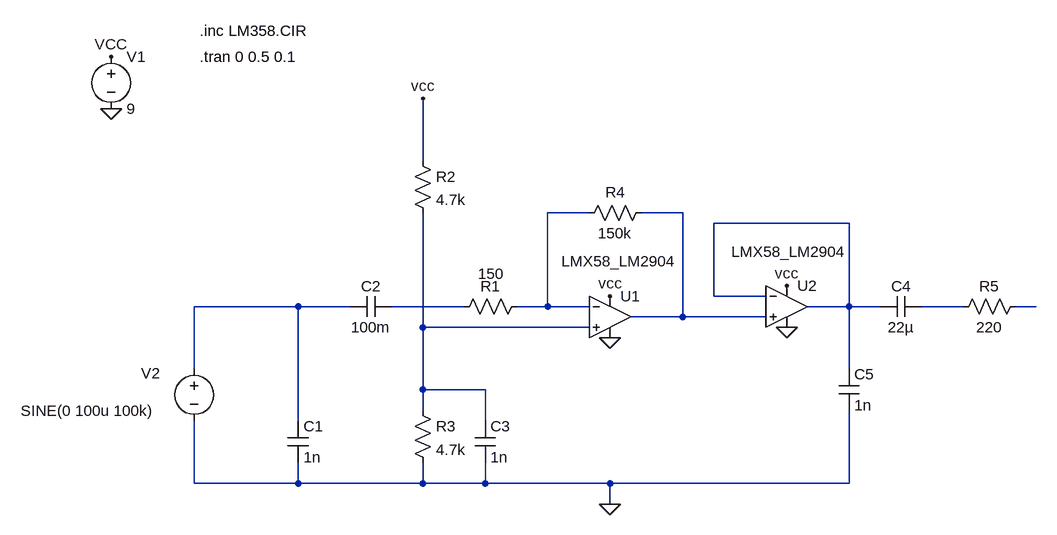
[diagram p0: schematic nadajnikv3.asc]
nadajnikv3.asc, the LTspice schematic file:
Version 4
SHEET 1 1428 996
WIRE 480 448 480 352
WIRE 736 528 672 528
WIRE 880 528 816 528
WIRE 1136 544 928 544
WIRE 928 656 928 544
WIRE 1008 656 928 656
WIRE 288 672 128 672
WIRE 368 672 288 672
WIRE 544 672 432 672
WIRE 672 672 672 528
WIRE 672 672 624 672
WIRE 736 672 672 672
WIRE 1136 672 1136 544
WIRE 1136 672 1072 672
WIRE 1184 672 1136 672
WIRE 1312 672 1248 672
WIRE 1424 672 1392 672
WIRE 880 688 880 528
WIRE 880 688 800 688
WIRE 1008 688 880 688
WIRE 480 704 480 528
WIRE 736 704 480 704
WIRE 128 768 128 672
WIRE 1136 768 1136 672
WIRE 480 800 480 704
WIRE 576 800 480 800
WIRE 480 832 480 800
WIRE 288 848 288 672
WIRE 576 848 576 800
WIRE 128 944 128 848
WIRE 288 944 288 912
WIRE 288 944 128 944
WIRE 480 944 480 912
WIRE 480 944 288 944
WIRE 576 944 576 912
WIRE 576 944 480 944
WIRE 768 944 576 944
WIRE 1136 944 1136 832
WIRE 1136 944 768 944
WIRE 768 976 768 944
FLAG 0 288 VCC
FLAG 0 368 0
FLAG 768 656 vcc
FLAG 768 720 0
FLAG 1040 704 0
FLAG 1040 640 vcc
FLAG 768 976 0
FLAG 480 352 vcc
SYMBOL voltage 0 272 R0
WINDOW 123 0 0 Left 0
WINDOW 39 0 0 Left 0
SYMATTR InstName V1
SYMATTR Value 9
SYMBOL OpAmps\\opamp2 768 624 R0
WINDOW 3 -75 -22 Left 2
SYMATTR Value LMX58_LM2904
SYMATTR InstName U1
SYMBOL res 832 512 R90
WINDOW 0 0 56 VBottom 2
WINDOW 3 32 56 VTop 2
SYMATTR InstName R4
SYMATTR Value 150k
SYMBOL res 464 432 R0
SYMATTR InstName R2
SYMATTR Value 4.7k
SYMBOL res 464 816 R0
SYMATTR InstName R3
SYMATTR Value 4.7k
SYMBOL cap 560 848 R0
SYMATTR InstName C3
SYMATTR Value 1n
SYMBOL cap 432 656 R90
WINDOW 0 0 32 VBottom 2
WINDOW 3 32 32 VTop 2
SYMATTR InstName C2
SYMATTR Value 100m
SYMBOL cap 272 848 R0
SYMATTR InstName C1
SYMATTR Value 1n
SYMBOL OpAmps\\opamp2 1040 608 R0
WINDOW 3 -85 -20 Left 2
SYMATTR Value LMX58_LM2904
SYMATTR InstName U2
SYMBOL cap 1120 768 R0
SYMATTR InstName C5
SYMATTR Value 1n
SYMBOL cap 1248 656 R90
WINDOW 0 0 32 VBottom 2
WINDOW 3 32 32 VTop 2
SYMATTR InstName C4
SYMATTR Value 22µ
SYMBOL res 1408 656 R90
WINDOW 0 0 56 VBottom 2
WINDOW 3 32 56 VTop 2
SYMATTR InstName R5
SYMATTR Value 220
SYMBOL voltage 128 752 R0
WINDOW 0 -82 23 Left 2
WINDOW 3 -267 80 Left 2
WINDOW 123 0 0 Left 0
WINDOW 39 0 0 Left 0
SYMATTR InstName V2
SYMATTR Value SINE(0 100u 100k)
SYMBOL res 640 656 R90
WINDOW 0 0 56 VBottom 2
WINDOW 3 -50 55 VTop 2
SYMATTR InstName R1
SYMATTR Value 150
TEXT 136 248 Left 2 !.inc LM358.CIR
TEXT 136 288 Left 2 !.tran 0 0.5 0.1

The netlist it stands for:
* nadajnikv3.asc
V1 VCC 0 9
XU1 N008 N001 VCC 0 N002 LMX58_LM2904  ; pins In+ In- V+ V- OUT
R4 N002 N001 150k
R2 VCC N008 4.7k
R3 N008 0 4.7k
C3 N008 0 1n
C2 N005 N004 100m
C1 N004 0 1n
XU2 N002 N003 VCC 0 N003 LMX58_LM2904  ; pins In+ In- V+ V- OUT
C5 N003 0 1n
C4 N006 N003 22µ
R5 N007 N006 220
V2 N004 0 SINE(0 100u 100k)
R1 N001 N005 150
.inc LM358.CIR
.tran 0 0.5 0.1
.backanno
.end